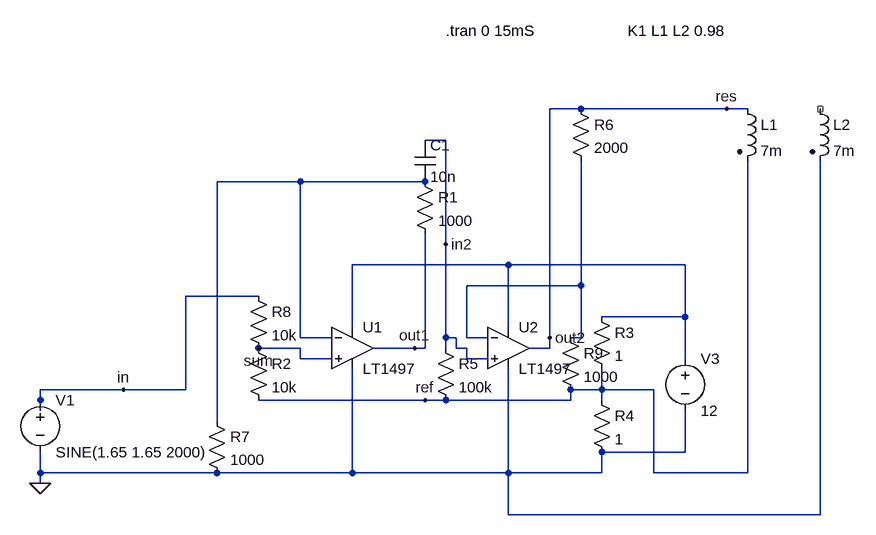
[diagram p0: schematic res2.asc]
res2.asc, the LTspice schematic file:
Version 4
SHEET 1 1220 680
WIRE 736 -112 688 -112
WIRE 960 -112 736 -112
WIRE 992 -112 960 -112
WIRE 528 -64 496 -64
WIRE 304 0 176 0
WIRE 496 0 304 0
WIRE 528 96 528 -64
WIRE 624 128 384 128
WIRE 896 128 624 128
WIRE 736 160 736 -32
WIRE 736 160 560 160
WIRE 240 176 128 176
WIRE 896 208 896 128
WIRE 896 208 768 208
WIRE 384 224 384 128
WIRE 624 224 624 128
WIRE 304 240 304 0
WIRE 352 240 304 240
WIRE 528 240 528 96
WIRE 544 240 528 240
WIRE 560 240 560 160
WIRE 592 240 560 240
WIRE 688 240 688 -112
WIRE 736 240 736 160
WIRE 736 240 720 240
WIRE 304 256 240 256
WIRE 480 256 416 256
WIRE 496 256 496 80
WIRE 496 256 480 256
WIRE 528 256 528 240
WIRE 544 256 544 240
WIRE 560 256 544 256
WIRE 688 256 688 240
WIRE 688 256 656 256
WIRE 304 272 304 256
WIRE 352 272 304 272
WIRE 560 272 560 256
WIRE 592 272 560 272
WIRE 896 272 896 208
WIRE 32 320 -96 320
WIRE 128 320 128 176
WIRE 128 320 32 320
WIRE 768 320 768 288
WIRE 768 320 720 320
WIRE 848 320 768 320
WIRE -96 336 -96 320
WIRE 496 336 240 336
WIRE 528 336 496 336
WIRE 720 336 720 320
WIRE 720 336 528 336
WIRE 768 336 768 320
WIRE -96 352 -96 336
WIRE 176 368 176 0
WIRE 896 416 896 352
WIRE 896 416 768 416
WIRE -96 448 -96 416
WIRE 176 448 -96 448
WIRE 384 448 384 288
WIRE 384 448 176 448
WIRE 624 448 624 288
WIRE 624 448 384 448
WIRE 768 448 768 416
WIRE 768 448 624 448
WIRE 848 448 848 320
WIRE 992 448 992 -32
WIRE 992 448 848 448
WIRE -96 464 -96 448
WIRE 624 512 624 448
WIRE 1104 512 1104 -32
WIRE 1104 512 624 512
FLAG -96 464 0
FLAG 32 320 in
FLAG 960 -112 res
FLAG 240 256 sum
FLAG 496 336 ref
FLAG 480 256 out1
FLAG 688 240 out2
FLAG 528 96 in2
SYMBOL voltage -96 320 R0
SYMATTR InstName V1
SYMATTR Value SINE(1.65 1.65 2000)
SYMATTR SpiceLine Rser=1
SYMBOL voltage 896 256 R0
SYMATTR InstName V3
SYMATTR Value 12
SYMATTR SpiceLine Rser=0
SYMBOL res 752 192 R0
SYMATTR InstName R3
SYMATTR Value 1
SYMBOL res 752 320 R0
SYMATTR InstName R4
SYMATTR Value 1
SYMBOL res 480 -16 R0
SYMATTR InstName R1
SYMATTR Value 1000
SYMBOL Opamps/LT1497 384 192 R0
SYMATTR InstName U1
SYMBOL ind2 976 -128 R0
SYMATTR InstName L1
SYMATTR Value 7m
SYMATTR Type ind
SYMATTR SpiceLine Rser=30
SYMBOL Opamps/LT1497 624 192 R0
SYMATTR InstName U2
SYMBOL ind2 1088 -128 R0
SYMATTR InstName L2
SYMATTR Value 7m
SYMBOL res 160 352 R0
SYMATTR InstName R7
SYMATTR Value 1000
SYMBOL res 224 240 R0
SYMATTR InstName R2
SYMATTR Value 10k
SYMBOL res 224 160 R0
SYMATTR InstName R8
SYMATTR Value 10k
SYMBOL res 512 240 R0
SYMATTR InstName R5
SYMATTR Value 100k
SYMBOL cap 480 -64 R0
SYMATTR InstName C1
SYMATTR Value 10n
SYMBOL res 720 -128 R0
SYMATTR InstName R6
SYMATTR Value 2000
SYMBOL res 704 224 R0
SYMATTR InstName R9
SYMATTR Value 1000
TEXT 528 -232 Left 2 !.tran 0 15mS
TEXT 808 -232 Left 2 !K1 L1 L2 0.98

The netlist it stands for:
* res2.asc
V1 in 0 SINE(1.65 1.65 2000) Rser=1
V3 N002 0 12 Rser=0
R3 N002 ref 1
R4 ref 0 1
R1 N001 out1 1000
XU1 sum N001 N002 0 out1 LT1497  ; pins In+ In- V+ V- OUT
L1 out2 ref 7m Rser=30
XU2 in2 N003 N002 0 out2 LT1497  ; pins In+ In- V+ V- OUT
L2 NC_01 0 7m
R7 N001 0 1000
R2 sum ref 10k
R8 in sum 10k
R5 in2 ref 100k
C1 in2 N001 10n
R6 out2 N003 2000
R9 N003 ref 1000
.tran 0 15mS
K1 L1 L2 0.98
.backanno
.end